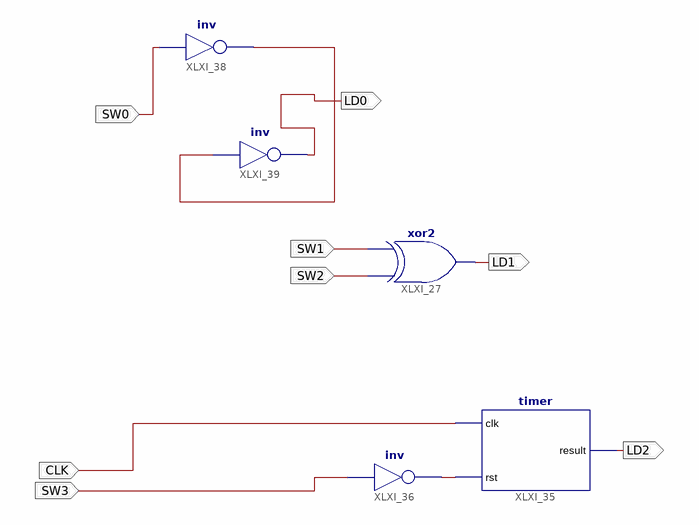
[diagram p0: schematic sheet 1]
// Xilinx ISE schematic logic.sch (spartan6) as structural Verilog: 5 symbols, 8 ports
module \logic  (
  input  CLK,
  input  SW2,
  input  SW0,
  input  SW1,
  input  SW3,
  output LD1,
  output LD2,
  output LD0
);

  wire XLXN_87, XLXN_89;

  xor XLXI_27 (LD1, SW2, SW1);
  timer XLXI_35 (.clk(CLK), .rst(XLXN_87), .result(LD2));
  not XLXI_36 (XLXN_87, SW3);
  not XLXI_38 (XLXN_89, SW0);
  not XLXI_39 (LD0, XLXN_89);
endmodule
